# EAGLE design andEight_mouv4k (EAGLE 7.7.0)
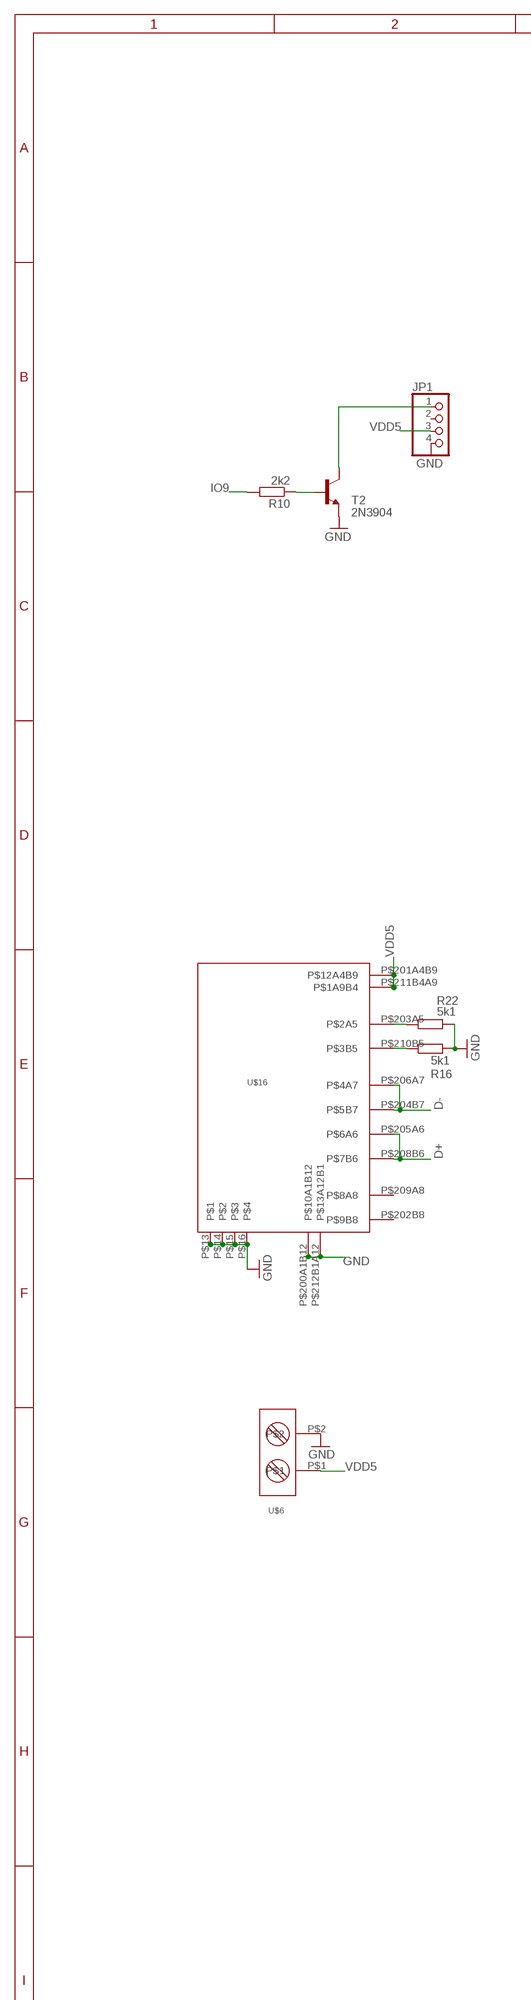
[diagram p0: schematic, sheet 1, part 1 of 2]
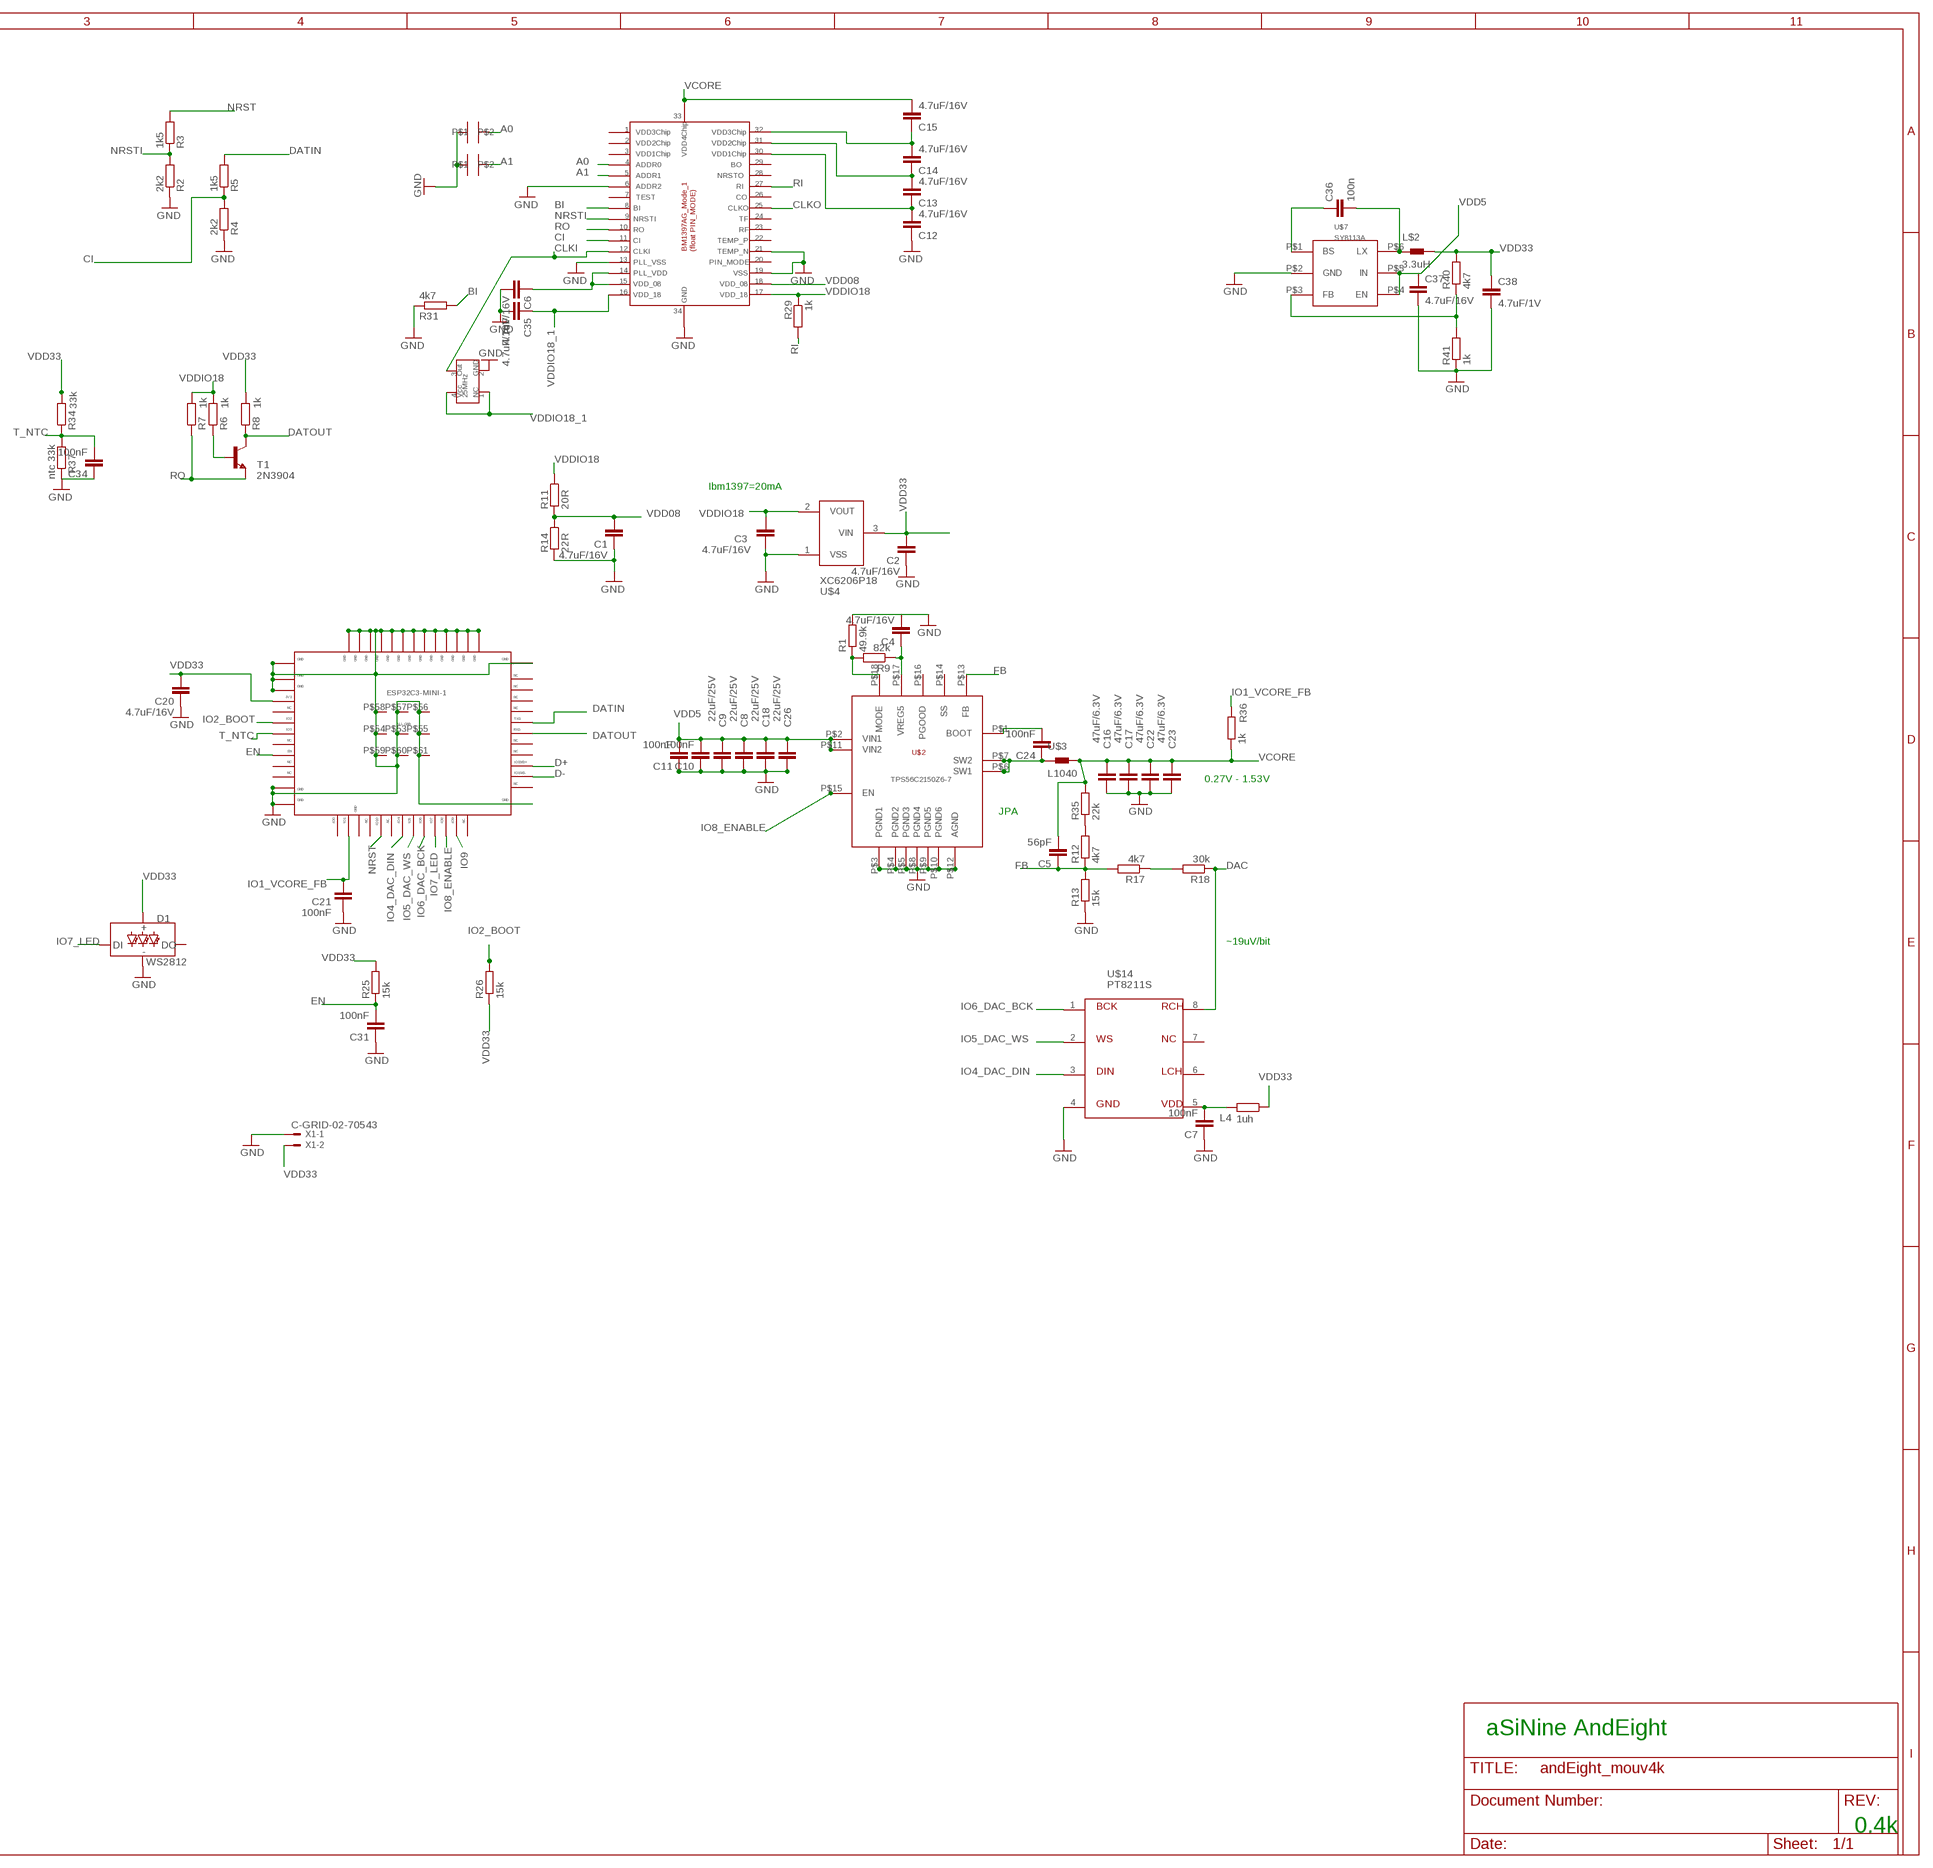
[diagram p1: schematic, sheet 1, part 2 of 2]

## Parts
A0  SOLDERJUMPER  [SOLDERJUMPER]
A1  SOLDERJUMPER  [SOLDERJUMPER]
C1  4.7uF/16V  C-EUC0402  [C0402]
C2  4.7uF/16V  C-EUC0402  [C0402]
C3  4.7uF/16V  C-EUC0402  [C0402]
C4  4.7uF/16V  C-EUC0402  [C0402]
C5  56pF  C-EUC0402  [C0402]
C6  4.7uF/16V  C-EUC0402  [C0402]
C7  100nF  C-EUC0402  [C0402]
C8  22uF/25V  C-EUC0805  [C0805]
C9  22uF/25V  C-EUC0805  [C0805]
C10  100nF  C-EUC0402  [C0402]
C11  100nF  C-EUC0402  [C0402]
C12  4.7uF/16V  C-EUC0402  [C0402]
C13  4.7uF/16V  C-EUC0402  [C0402]
C14  4.7uF/16V  C-EUC0402  [C0402]
C15  4.7uF/16V  C-EUC0402  [C0402]
C16  47uF/6.3V  C-EUC0805  [C0805]
C17  47uF/6.3V  C-EUC0805  [C0805]
C18  22uF/25V  C-EUC0805  [C0805]
C20  4.7uF/16V  C-EUC0603  [C0603]
C21  100nF  C-EUC0603  [C0603]
C22  47uF/6.3V  C-EUC0805  [C0805]
C23  47uF/6.3V  C-EUC0805  [C0805]
C24  100nF  C-EUC0402  [C0402]
C26  22uF/25V  C-EUC0805  [C0805]
C31  100nF  C-EUC0402  [C0402]
C34  100nF  C-EUC0402  [C0402]
C35  4.7uF/16V  C-EUC0402  [C0402]
C36  100n  C-EUC0402  [C0402]
C37  4.7uF/16V  C-EUC0402  [C0402]
C38  4.7uF/1V  C-EUC0402  [C0402]
D1  WS2812  WS2812_5050  [WS2812-5X5-4PIN]
ESP32C3-MINI-1  ESP32-C3-MINI-1  ESP32C3MINI  [ESP32C3MINI]
JP1  PINHD-1X4/90  [1X04/90]
L4  1uh  R-EU_R0402  [R0402]
L$2  3.3uH  NR201610  [NR201610]
R1  49.9k  R-EU_R0402  [R0402]
R2  2k2  R-EU_R0402  [R0402]
R3  1k5  R-EU_R0402  [R0402]
R4  2k2  R-EU_R0402  [R0402]
R5  1k5  R-EU_R0402  [R0402]
R6  1k  R-EU_R0402  [R0402]
R7  1k  R-EU_R0402  [R0402]
R8  1k  R-EU_R0402  [R0402]
R9  82k  R-EU_R0402  [R0402]
R10  2k2  R-EU_R0402  [R0402]
R11  20R  R-EU_R0402  [R0402]
R12  4k7  R-EU_R0402  [R0402]
R13  15k  R-EU_R0402  [R0402]
R14  22R  R-EU_R0402  [R0402]
R16  5k1  R-EU_R0402  [R0402]
R17  4k7  R-EU_R0402  [R0402]
R18  30k  R-EU_R0402  [R0402]
R22  5k1  R-EU_R0402  [R0402]
R25  15k  R-EU_R0402  [R0402]
R26  15k  R-EU_R0402  [R0402]
R29  1k  R-EU_R0402  [R0402]
R31  4k7  R-EU_R0402  [R0402]
R34  33k  R-EU_R0603  [R0603]
R35  22k  R-EU_R0402  [R0402]
R36  1k  R-EU_R0402  [R0402]
R37  ntc 33k  R-EU_R0402  [R0402]
R40  4k7  R-EU_R0402  [R0402]
R41  1k  R-EU_R0402  [R0402]
T1  2N3904  BC847  [SOT23]
T2  2N3904  BC847  [SOT23]
U$1  BM1397-1  [BM1391]
U$2  TPS56C2150Z6-7  [VQFN-HR]
U$3  L1040  [L1040]
U$4  XC6206P18  XC6206P  [SOT23]
U$6  DG301-50  [DG301-50]
U$7  SY8113A  [SOT23L-6]
U$14  PT8211S  PT8211  [SO-8]
U$16  USBCTHT  [USBCSMTTHT]
U$22  25MHz  OSC3225  [3225]
X1  C-GRID-02-70543  [70543-02]

## Nets
A0: A0.P$1 U$1.P$4
A1: A1.P$1 U$1.P$5
BI: R31.2 U$1.P$8
CI: R4.2 R5.1 U$1.P$11
CLKI: U$1.P$12 U$22.P$3
CLKO: U$1.P$25
D+: ESP32C3-MINI-1.P$27 U$16.P$205A6(P$6A6) U$16.P$208B6(P$7B6)
D-: ESP32C3-MINI-1.P$26 U$16.P$204B7(P$5B7) U$16.P$206A7(P$4A7)
DAC: R18.1 U$14.8
DATIN: ESP32C3-MINI-1.P$31 R5.2
DATOUT: ESP32C3-MINI-1.P$30 R8.1 T1.3(C)
EN: C31.2 ESP32C3-MINI-1.P$8 R25.1
FB: C5.1 R12.1 R13.2 R17.2 U$2.P$13(FB)
GND: A0.P$2 A1.P$2 C1.1 C2.1 C3.1 C4.2 C6.2 C7.1 C8.2 C9.2 C10.1 C11.1 C12.1 C16.2 C17.2 C18.2 C20.1 C21.1 C22.2 C23.2 C26.2 C31.1 C34.1 C35.2 C37.2 C38.2 D1.GND ESP32C3-MINI-1.P$1 ESP32C3-MINI-1.P$2 ESP32C3-MINI-1.P$11 ESP32C3-MINI-1.P$36 ESP32C3-MINI-1.P$37 ESP32C3-MINI-1.P$38 ESP32C3-MINI-1.P$39 ESP32C3-MINI-1.P$40 ESP32C3-MINI-1.P$41 ESP32C3-MINI-1.P$42 ESP32C3-MINI-1.P$43 ESP32C3-MINI-1.P$44 ESP32C3-MINI-1.P$45 ESP32C3-MINI-1.P$46 ESP32C3-MINI-1.P$47 ESP32C3-MINI-1.P$48 ESP32C3-MINI-1.P$49 ESP32C3-MINI-1.P$50 ESP32C3-MINI-1.P$51 ESP32C3-MINI-1.P$52 ESP32C3-MINI-1.P$53 ESP32C3-MINI-1.P$54 ESP32C3-MINI-1.P$55 ESP32C3-MINI-1.P$56 ESP32C3-MINI-1.P$57 ESP32C3-MINI-1.P$58 ESP32C3-MINI-1.P$59 ESP32C3-MINI-1.P$60 ESP32C3-MINI-1.P$61 JP1.4 R1.2 R2.1 R4.1 R13.1 R14.2 R16.2 R22.2 R31.1 R37.1 R41.1 T2.2(E) U$1.P$6 U$1.P$13 U$1.P$19 U$1.P$21 U$1.P$34 U$2.P$3(PGND1) U$2.P$4(PGND2) U$2.P$5(PGND3) U$2.P$8(PGND4) U$2.P$9(PGND5) U$2.P$10(PGND6) U$2.P$12(AGND) U$4.1(VSS) U$6.P$2 U$7.P$2(GND) U$14.4 U$16.P$13 U$16.P$14 U$16.P$15 U$16.P$16 U$16.P$200A1B12(P$10A1B12) U$16.P$212B1A12(P$13A12B1) U$22.P$2 X1.1
IO1_VCORE_FB: C21.2 ESP32C3-MINI-1.P$13 R36.2
IO2_BOOT: ESP32C3-MINI-1.P$5 R26.2
IO4_DAC_DIN: ESP32C3-MINI-1.P$18 U$14.3
IO5_DAC_WS: ESP32C3-MINI-1.P$19 U$14.2
IO6_DAC_BCK: ESP32C3-MINI-1.P$20 U$14.1
IO7_LED: D1.DI ESP32C3-MINI-1.P$21
IO8_ENABLE: ESP32C3-MINI-1.P$22 U$2.P$15(EN)
IO9: ESP32C3-MINI-1.P$23 R10.2
N$1: R10.1 T2.1(B)
N$2: C24.2 U$2.P$1(BOOT)
N$3: C24.1 U$2.P$6(SW1) U$2.P$7(SW2) U$3.P$1
N$6: C4.1 R9.1 U$2.P$17(VREG5)
N$7: R1.1 R9.2 U$2.P$18(MODE)
N$9: JP1.1 T2.3(C)
N$12: C36.1 U$7.P$1(BS)
N$17: C36.2 L$2.P$1 U$7.P$6(LX)
N$18: R40.1 R41.2 U$7.P$3(FB)
N$21: R16.1 U$16.P$210B5(P$3B5)
N$22: R22.1 U$16.P$203A5(P$2A5)
N$27: R6.1 T1.1(B)
N$28: R12.2 R35.1
N$39: R17.1 R18.2
NRST: ESP32C3-MINI-1.P$16 R3.2
NRSTI: R2.2 R3.1 U$1.P$9
P$5: C7.2 L4.2 U$14.5
RI: R29.2 U$1.P$27
RO: R7.1 T1.2(E) U$1.P$10
T_NTC: C34.2 ESP32C3-MINI-1.P$6 R34.1 R37.2
VCORE: C5.2 C15.2 C16.1 C17.1 C22.1 C23.1 R35.2 R36.1 U$1.P$33 U$3.P$2
VDD1: C12.2 C13.1 U$1.P$30
VDD2: C13.2 C14.1 U$1.P$31
VDD3: C14.2 C15.1 U$1.P$32
VDD5: C8.1 C9.1 C10.2 C11.2 C18.1 C26.1 C37.1 JP1.3 U$2.P$2(VIN1) U$2.P$11(VIN2) U$6.P$1 U$7.P$4(EN) U$7.P$5(IN) U$16.P$201A4B9(P$12A4B9) U$16.P$211B4A9(P$1A9B4)
VDD08: C1.2 R11.2 R14.1 U$1.P$18
VDD08_1: C6.1 U$1.P$14 U$1.P$15
VDD33: C2.2 C20.2 C38.1 D1.VCC ESP32C3-MINI-1.P$3 L4.1 L$2.P$2 R8.2 R25.2 R26.1 R34.2 R40.2 U$4.3(VIN) X1.2
VDDIO18: C3.2 R6.2 R7.2 R11.1 R29.1 U$1.P$17 U$4.2(VOUT)
VDDIO18_1: C35.1 U$1.P$16 U$22.P$1 U$22.P$4
Unconnected: D1.DO ESP32C3-MINI-1.P$4 ESP32C3-MINI-1.P$7 ESP32C3-MINI-1.P$9 ESP32C3-MINI-1.P$10 ESP32C3-MINI-1.P$12 ESP32C3-MINI-1.P$14 ESP32C3-MINI-1.P$15 ESP32C3-MINI-1.P$17 ESP32C3-MINI-1.P$24 ESP32C3-MINI-1.P$25 ESP32C3-MINI-1.P$28 ESP32C3-MINI-1.P$29 ESP32C3-MINI-1.P$32 ESP32C3-MINI-1.P$33 ESP32C3-MINI-1.P$34 ESP32C3-MINI-1.P$35 JP1.2 U$1.P$1 U$1.P$2 U$1.P$3 U$1.P$7 U$1.P$20 U$1.P$22 U$1.P$23 U$1.P$24 U$1.P$26 U$1.P$28 U$1.P$29 U$2.P$14(SS) U$2.P$16(PGOOD) U$14.6 U$14.7 U$16.P$202B8(P$9B8) U$16.P$209A8(P$8A8)

## Notes on the sheet
- Ibm1397=20mA
- 0.27V - 1.53V
- JPA
- ~19uV/bit
- aSiNine AndEight
- 0.4k

## Library data of the parts
A0 A1 = vishay-fet:SOLDERJUMPER
C1-C18 C20-C24 C26 C31 C34-C38 = rcl:C-EU: CAPACITOR, European symbol
D1 = SparkFun-LED:WS2812: Addressable RGB LED - 1 Wire Common names: WS2812, SK6812, Neopixel, APA-106, etc. SMD LED with built-in controller IC. Color: Red/Green/Blue SparkFun Products: LED-SMD RGB (WS2812) <https://www.sparkfun.com/products/11821> LED - RGB Addressable, PTH, 5mm Diffused (5 Pack) <https://www.sparkfun.com/products/12986> LED - RGB Addressable, PTH, 5mm Clear (5 Pack) <https://www.sparkfun.com/products/12999> Blynk Board - ESP8266 <https://www.sparkfun.com/products/13794> Datasheet referenced for footprint: WS2812B-PTH <https://cdn.sparkfun.com/datasheets/Components/LED/COM-12877.pdf>; PROD_ID: DIO-12503
ESP32C3-MINI-1 = esp32c3:ESP32C3MINI
JP1 = pinhead:PINHD-1X4: PIN HEADER
L4 R1-R14 R16-R18 R22 R25 R26 R29 R31 R34-R37 R40 R41 = rcl:R-EU_: RESISTOR, European symbol
L$2 = vishay-fet:NR201610
T1 T2 = transistor:BC847: NPN TRANSISTOR
U$1 = bm1387:BM1397-1
U$2 = vishay-fet:TPS56C2150Z6-7
U$3 = vishay-fet:L1040
U$4 = vishay-fet:XC6206P
U$6 = vishay-fet:DG301-50
U$7 = vishay-fet:SY8113A
U$14 = vishay-fet:PT8211
U$16 = usbc:USBC
U$22 = vishay-fet:OSC3225: Active oscillator 3225 pin 1 is either NC or Enable(pull high)
X1 = con-molex:C-GRID-02: CONNECTOR wire to board 2.54 mm (0.100") pitch header; OC_FARNELL: unknown; OC_NEWARK: unknown

## Board
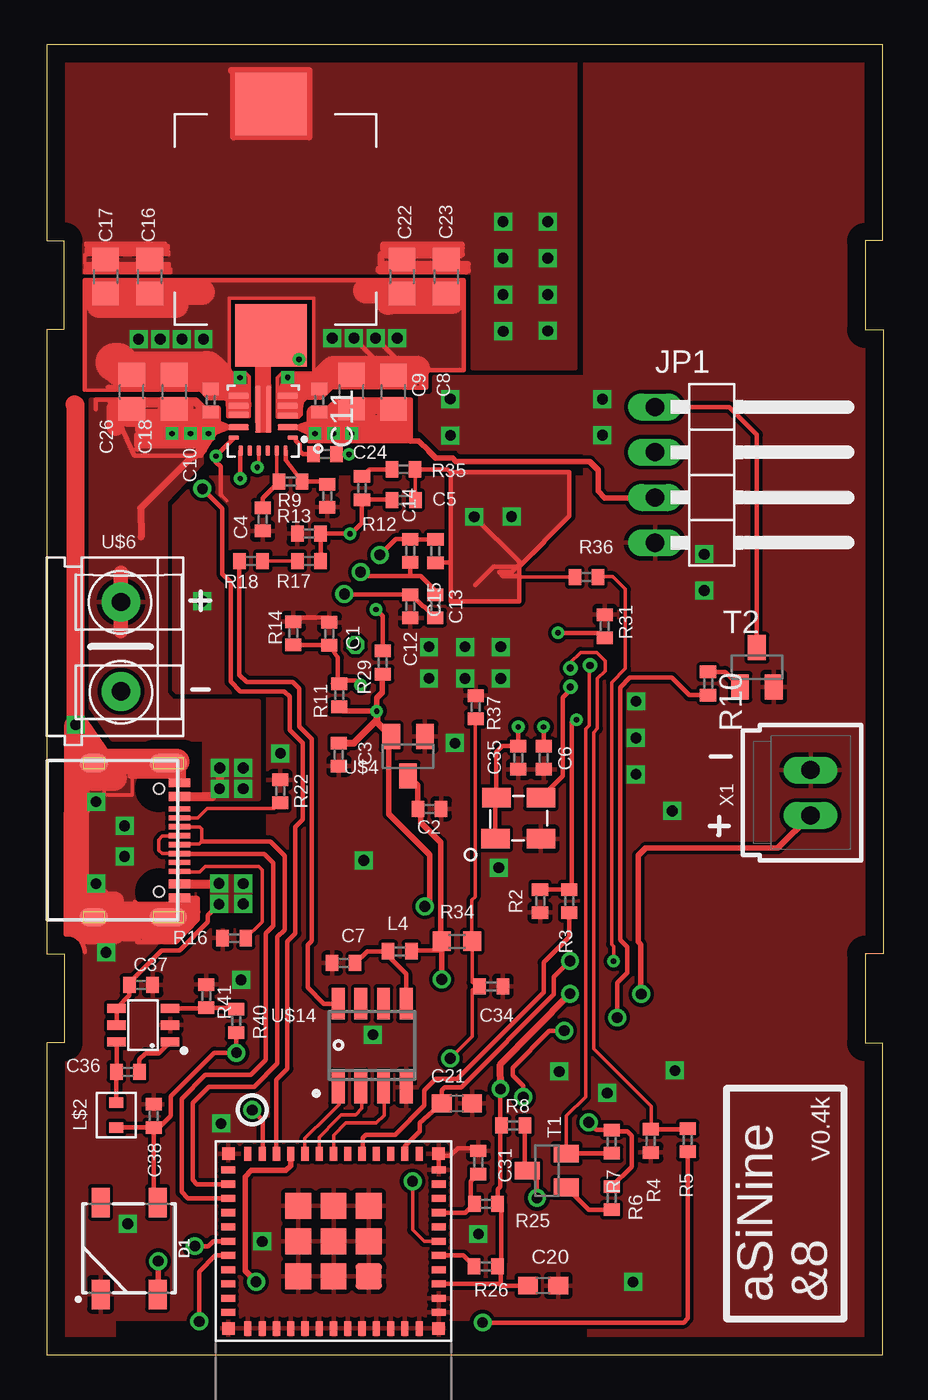
[diagram p2: board, top side]
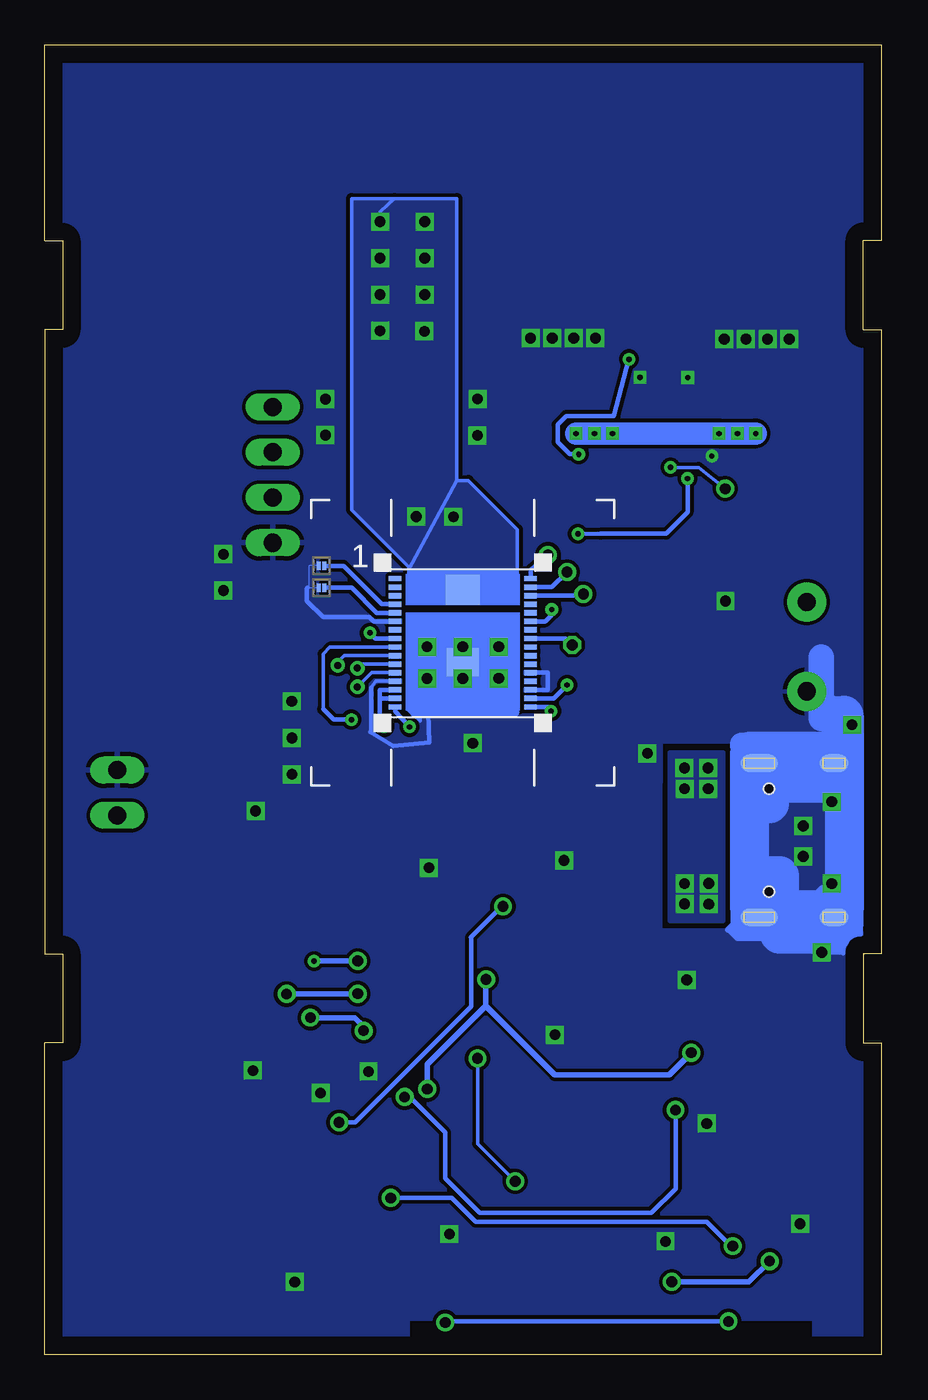
[diagram p3: board, bottom side, seen from below]

Size 46.91 x 73.5 mm. Coordinates in mm from the lower left corner, seen from the top.
Outline: 0,0 46.9,0 46.9,17.5 45.9,17.5 45.9,22.5 46.91,22.5 46.91,57.5 45.9,57.5 45.9,62.5 46.9,62.5 46.9,73.5 0,73.5 0,62.5 0.99,62.51 1,57.5 0,57.5 0,22.5 1,22.5 1,17.5 0,17.5 0,0
Copper layers (1*16): Top 0.035mm / dielectric 1.5mm / Bottom 0.035mm
Design rules "default": minimum track width 10mil, minimum drill 24mil, track to track 8mil, track to pad 8mil, pad to pad 8mil, via to via 8mil, smd to smd 8mil, copper to edge 40mil, drill to drill 8mil, minimum pad ring 10mil, minimum via ring 8mil, stop-mask expansion 4mil, vias tented up to drill 0mil, thermal gap 10mil
tRestrict: area 3.9,0.1 to 9.7,1.9; area 3.9,0.1 to 9.7,1.9; area 22.4,0.3 to 30.3,1.9
bRestrict: area 3.9,0.1 to 9.7,1.9; area 22.4,0.3 to 26.4,1.9

### Footprints (pad centres in the part's own frame; a part is rotated, then mirrored left to right if it is on the bottom)
SOLDERJUMPER = smd 0.229 x 0.457: P$1 -0.152,0; P$2 0.152,0
C0402 = smd 0.7 x 0.9: 1 -0.65,0; 2 0.65,0
C0805 = smd 1.3 x 1.5: 1 -0.95,0; 2 0.95,0
C0603 = smd 1.1 x 1: 1 -0.85,0; 2 0.85,0
WS2812-5X5-4PIN = smd 1.651 x 1: DI 2.577,1.6; DO -2.577,-1.6; GND 2.577,-1.6; VCC -2.577,1.6
ESP32C3MINI = smd 0.8 x 0.4: P$1 -5.9,4; P$2 -5.9,3.2; P$3 -5.9,2.4; P$4 -5.9,1.6; P$5 -5.9,0.8; P$6 -5.9,0; P$7 -5.9,-0.8; P$8 -5.9,-1.6; P$9 -5.9,-2.4; P$10 -5.9,-3.2; P$11 -5.9,-4; P$25 5.9,-4; P$26 5.9,-3.2; P$27 5.9,-2.4; P$28 5.9,-1.6; P$29 5.9,-0.8; P$30 5.9,0; P$31 5.9,0.8; P$32 5.9,1.6; P$33 5.9,2.4; P$34 5.9,3.2; P$35 5.9,4 | smd 0.4 x 0.8: P$12 -4.8,-4.9; P$13 -4,-4.9; P$14 -3.2,-4.9; P$15 -2.4,-4.9; P$16 -1.6,-4.9; P$17 -0.8,-4.9; P$18 0,-4.9; P$19 0.8,-4.9; P$20 1.6,-4.9; P$21 2.4,-4.9; P$22 3.2,-4.9; P$23 4,-4.9; P$24 4.8,-4.9; P$36 4.8,4.9; P$37 4,4.9; P$38 3.2,4.9; P$39 2.4,4.9; P$40 1.6,4.9; P$41 0.8,4.9; P$42 0,4.9; P$43 -0.8,4.9; P$44 -1.6,4.9; P$45 -2.4,4.9; P$46 -3.2,4.9; P$47 -4,4.9; P$48 -4.8,4.9 | smd 0.7 x 0.7: P$49 5.9,4.9; P$50 5.9,-4.9; P$51 -5.9,-4.9; P$52 -5.9,4.9 | smd 1.45 x 1.45: P$53 0,0; P$54 1.975,0; P$55 -1.975,0; P$56 -1.975,1.975; P$57 0,1.975; P$58 1.975,1.975; P$59 1.975,-1.975; P$60 0,-1.975; P$61 -1.975,-1.975
1X04/90 = drill 1.016 long: 1 -3.81,-3.81; 2 -1.27,-3.81; 3 1.27,-3.81; 4 3.81,-3.81
R0402 = smd 0.7 x 0.9: 1 -0.65,0; 2 0.65,0
NR201610 = smd 0.6 x 0.77: P$1 -0.7,0; P$2 0.7,0
R0603 = smd 1 x 1.1: 1 -0.85,0; 2 0.85,0
SOT23 = smd 1 x 1.4: 1 -0.95,-1.1; 2 0.95,-1.1; 3 0,1.1
BM1391 = smd 0.7 x 0.3: P$1 3.8,-3.6; P$2 3.8,-3.12; P$3 3.8,-2.64; P$4 3.8,-2.16; P$5 3.8,-1.68; P$6 3.8,-1.2; P$7 3.8,-0.72; P$8 3.8,-0.24; P$9 3.8,0.24; P$10 3.8,0.72; P$11 3.8,1.2; P$12 3.8,1.68; P$13 3.8,2.16; P$14 3.8,2.64; P$15 3.8,3.12; P$16 3.8,3.6; P$17 -3.8,3.6; P$18 -3.8,3.12; P$19 -3.8,2.64; P$20 -3.8,2.16; P$21 -3.8,1.68; P$22 -3.8,1.2; P$23 -3.8,0.72; P$24 -3.8,0.24; P$25 -3.8,-0.24; P$26 -3.8,-0.72; P$27 -3.8,-1.2; P$28 -3.8,-1.68; P$29 -3.8,-2.16; P$30 -3.8,-2.64; P$31 -3.8,-3.12; P$32 -3.8,-3.6 | smd 1.9 x 1.7: P$33 0,-2.98 | smd 1.8 x 1.6: P$34 0,1.1
VQFN-HR = smd 0.6 x 0.25: P$1 -1.65,0.925; P$12 1.65,0.925 | smd 1.15 x 0.35: P$2 -1.375,0.35; P$11 1.375,0.35 | smd 1.15 x 0.3: P$3 -1.375,-0.3; P$4 -1.375,-0.85; P$5 -1.375,-1.4; P$8 1.375,-1.4; P$9 1.375,-0.85; P$10 1.375,-0.35 | smd 0.3 x 2.6: P$6 -0.3,-0.65; P$7 0.3,-0.65 | smd 0.25 x 0.6: P$13 1.25,1.65; P$14 0.75,1.65; P$15 0.25,1.65; P$16 -0.25,1.65; P$17 -0.75,1.65; P$18 -1.25,1.65
L1040 = smd 3.5 x 4: P$1 -6.5,0; P$2 6.5,0
DG301-50 = drill 1.016 pad 2.184: P$1 -2.5,0.05; P$2 2.5,0.05
SOT23L-6 = smd 0.508 x 1.016: P$1 -0.95,-1.45; P$2 0,-1.45; P$3 0.95,-1.45; P$4 0.95,1.55; P$5 0,1.55; P$6 -0.95,1.55
SO-8 = smd 0.72 x 1.78: 1 -1.905,-2.35; 2 -0.635,-2.35; 3 0.635,-2.35; 4 1.905,-2.35; 5 1.905,2.35; 6 0.635,2.35; 7 -0.635,2.35; 8 -1.905,2.35
USBCSMTTHT = smd 1 x 1.6 bottom: P$1 -4.32,2.6; P$2 4.32,2.6 | smd 1 x 2.1 bottom: P$6 4.32,6.78; P$115 -4.32,6.78 | smd 1 x 1.6: P$13 -4.32,2.6; P$14 4.32,2.6 | smd 1 x 2.1: P$15 -4.32,6.78; P$16 4.32,6.78 | smd 0.5 x 1.2: P$200A1B12 -3.225,7.4; P$201A4B9 -2.45,7.4; P$211B4A9 2.45,7.4; P$212B1A12 3.225,7.4 | smd 0.3 x 1.2: P$202B8 -1.75,7.4; P$203A5 -1.25,7.4; P$204B7 -0.75,7.4; P$205A6 -0.25,7.4; P$206A7 0.25,7.4; P$208B6 0.75,7.4; P$209A8 1.25,7.4; P$210B5 1.75,7.4 | hole 0.6: 2.89,6.25; -2.89,6.25
3225 = smd 1.6 x 1.1: P$1 -1.3,-1.15; P$2 1.25,-1.15; P$3 1.25,1.15; P$4 -1.25,1.15
70543-02 = drill 1.016 long: 1 -1.27,0; 2 1.27,0

### Placement (x,y rotation side)
A0  31.38,44.27 180 bottom
A1  31.38,43.03 180 bottom
C1  15.85,40.44 270 top
C2  21.48,30.63 180 top
C3  16.39,33.67 90 top
C4  12.11,46.87 270 top
C5  20.02,47.96 0 top
C6  27.88,33.5 270 top
C7  16.66,21.98 0 top
C8  19.45,54.02 90 top
C9  17.1,54.02 90 top
C10  9.2,53.55 270 top
C11  15.29,53.55 270 top
C12  20.4,41.99 90 top
C13  21.8,42 90 top
C14  20.39,45.11 90 top
C15  21.81,45.09 270 top
C16  5.79,60.49 270 top
C17  3.31,60.49 270 top
C18  7.16,54.02 90 top
C20  27.84,3.89 180 top
C21  23.01,14.11 180 top
C22  19.93,60.49 270 top
C23  22.41,60.49 270 top
C24  15.61,50.52 180 top
C26  4.78,54.02 90 top
C31  24.21,10.8 270 top
C34  24.94,20.68 180 top
C35  26.45,33.5 270 top
C36  4.56,15.89 180 top
C37  5.3,20.75 0 top
C38  6.02,13.41 90 top
D1  4.63,5.98 270 top
ESP32C3-MINI-1  16.09,6.38 180 top
JP1  37.93,49.37 270 top
L4  19.81,22.65 180 top
L$2  3.91,13.45 270 top
R1  15.75,48.2 270 top
R2  27.67,25.46 90 top
R3  29.32,25.46 270 top
R4  33.88,12.01 90 top
R5  35.95,12.05 270 top
R6  31.69,8.8 90 top
R7  31.69,11.97 90 top
R8  26.17,12.87 180 top
R9  13.69,48.99 0 top
R10  37.09,37.66 270 top
R11  16.4,37 90 top
R12  17.69,48.62 90 top
R13  14.71,46.07 0 top
R14  13.84,40.48 90 top
R16  10.52,23.38 180 top
R17  14.71,44.53 0 top
R18  11.47,44.53 0 top
R22  13.09,31.61 90 top
R25  24.64,8.48 0 top
R26  24.63,4.97 180 top
R29  18.85,38.84 90 top
R31  31.31,40.87 270 top
R34  23.02,23.2 180 top
R35  20.02,49.67 0 top
R36  30.27,43.62 0 top
R37  24.06,36.33 270 top
R40  10.63,18.73 270 top
R41  8.95,20.12 270 top
T1  28.05,10.34 90 top
T2  39.83,38.58 0 top
U$1  23.46,39.95 180 bottom
U$2  12.15,52.38 180 top
U$3  12.59,63.68 90 top
U$4  20.27,33.59 180 top
U$6  4.12,39.73 270 top
U$7  5.47,18.5 90 top
U$14  18.26,17.36 0 top
U$16  0.05,28.87 270 top
U$22  26.47,30.1 0 top
X1  42.84,31.54 270 top

### Tracks (layer width: path | path; a pad name or v marks a point on that pad's centre or on a via)
A0
  Bottom 0: 31.21,44.25 A0.P$1
  Bottom 0.254: U$1.P$4 28.01,42.11 30.15,44.25 31.21,44.25
A1
  Bottom 0: 31.21,43.05 A1.P$1
  Bottom 0.254: U$1.P$5 28.28,41.63 29.7,43.05 31.21,43.05
BI  (via drill 0.3)
  Top 0.254: v28.68,40.5 31.03,40.5 R31.2
  Bottom 0.254: U$1.P$8 28.36,40.19 v28.68,40.5
CI  (via drill 0.4)
  Top 0.203: v29.38,38.52 29.38,38.83 29.95,39.4 30.85,39.4 31.32,38.92 31.32,38.38 30.89,37.94 30.89,35.14 30.68,34.92 30.68,17.18 33.9,13.95 33.9,12.68 R4.2
  Top 0.254: R4.2 35.91,12.66 R5.1
  Bottom 0.203: U$1.P$11 29.2,38.75 v29.38,38.52
CLKI  (via drill 0.4)
  Top 0.254: 27.7,31.17 U$22.P$3 28.95,32.48 28.95,36.88 29.38,37.3 v29.38,37.48
  Bottom 0.203: v29.38,37.48 28.57,38.27 U$1.P$12
CLKO  (via drill 0.6)
  Bottom 0.254: U$1.P$25 17.69,40.19 v17.32,39.83
D+
  Top 0.203: U$16.P$208B6 6.48,28.12 6.3,28.3 6.3,28.9 6.5,29.1 7.43,29.1 U$16.P$205A6
  Top 0.254: ESP32C3-MINI-1.P$27 10.18,8.79 7.93,8.79 7.58,9.14 7.58,14.38 8.9,15.7 11.45,15.7 12.3,16.55 12.3,23.65 12.7,24.05 12.7,27.6 12.2,28.1 7.47,28.1 U$16.P$208B6
D-
  Top 0.203: U$16.P$204B7 8.58,29.62 8.7,29.5 8.7,28.8 8.55,28.65 7.48,28.65 U$16.P$206A7
  Top 0.254: ESP32C3-MINI-1.P$26 8.42,9.57 8.19,9.82 8.19,14.14 9.1,15.05 11.65,15.05 12.95,16.35 12.95,23.45 13.35,23.85 13.35,28 12.55,28.8 8.7,28.8
DAC
  Top 0.254: U$14.8 16.34,19.7 15.55,19.7 14.64,20.61 14.64,22.99 14.88,23.22 14.88,34.54 14.35,35.06 14.18,35.25 14.18,37.38 13.8,37.74 11.21,37.74 10.81,38.15 R18.1 10.62,44.51
DATIN  (via drill 0.6 pad 0.61)
  Top 0.254: ESP32C3-MINI-1.P$31 9.47,5.58 8.57,4.67 v8.57,1.88 | v24.45,1.82 35.72,1.82 35.95,2.05 R5.2
  Bottom 0.254: v8.57,1.88 24.38,1.88 v24.45,1.82
DATOUT  (via drill 0.6)
  Top 0.254: v8.32,6.11 9.07,6.11 9.34,6.38 ESP32C3-MINI-1.P$30 | R8.1 26.82,10.47 T1.3 27.5,9.79 v27.5,8.8
  Bottom 0.254: v8.32,6.11 8.41,6.11 9.78,7.48 22.75,7.48 24.07,8.8 v27.5,8.8
EN
  Top 0.254: 22.03,7.96 23.47,7.96 R25.1 23.79,8.66 23.79,9.73 C31.2
  Top 0.305: 22.03,7.96 ESP32C3-MINI-1.P$8
FB  (via drill 0.3)
  Top 0.203: 10.88,50.71 U$2.P$13
  Top 0.254: C5.1 19.16,47.97 R12.1 17.69,46.67 17.09,46.07 16.96,46.07 | R17.2 15.36,44.78 R13.2 16.96,46.07 | v17.01,46.06 16.98,46.06 16.96,46.07 | 10.88,50.71 10.88,49.17 v10.86,49.16
  Bottom 0.254: v10.86,49.16 10.86,47.27 12.06,46.07 15.75,46.07 v17.01,46.06
GND  (via drill 0.3, 0.6)
  Top 0.203: 1.9,32.35 3.25,32.35 3.25,31.4 4.8,31.4 4.8,33.15 2.65,33.15 U$16.P$13 | 3.05,33.3 6.83,33.3 U$16.P$15 | 7.3,33.3 7.55,33.3 7.55,33.05 | U$16.P$200A1B12 7.45,32.15 | 7.35,25.45 7.45,25.45 U$16.P$212B1A12 | 9.8,48.23 10.11,47.92 | U$16.P$14 2.65,25.1 2.08,25.68 1.72,25.68 1.68,25.64 | U$16.P$16 6.83,24.84 6.83,24.85 | 21.28,54.26 16.02,54.26 15.42,53.66 14.55,53.66 14.29,53.38 14.29,52.74 14.15,52.62 12.95,52.62 12.95,54.83 13.2,55.08 14.97,55.08 14.97,59.28 10.23,59.28 10.23,55.08 11.18,55.08 11.38,54.88 11.38,52.62 10.15,52.62 10.15,53.51 10,53.66 9.07,53.66 8.62,54.11 2.12,54.12 2.12,54.62 | 2.45,60.15 2.46,60.15 2.46,59.7 2.33,59.7 2.33,60.28
  Top 0.254: ESP32C3-MINI-1.P$11 ESP32C3-MINI-1.P$51 22.17,11.16 22.61,11.16 23.05,11.6 24.16,11.6 C31.1 | R14.2 14.08,41.13 14.3,41.35 15.8,41.35 C1.1 | 8,25.05 7.75,25.05 | 7.75,25.05 7.75,25.21 | 7.75,25.21 7.75,25.65 | 7.75,25.65 7.2,25.65 7.2,25.05 5.3,25.05 4.95,25.4 4.95,25.25 5.35,24.85 6.83,24.85 7.9,24.85 | 8,24.45 8,24.55 7.62,24.93 | 7.62,24.93 7.55,25 7.55,25.45 7.35,25.45 7.35,25.05 | 6.55,32.9 7.2,32.9 7.2,32.15 7.45,32.15 7.7,32.15 7.7,33.05 7.55,33.05 7.55,32.3 7.4,32.3 7.4,32.8 | 1.09,24.09 1.09,23.6 1.15,23.6 | 1.15,23.6 arc-90 2.14,22.61 | 1.15,23.6 1.6,23.6 1.6,23.98 3.21,23.98 | 3.34,23.98 v3.34,22.57 | 2.9,23.34 5.17,23.34 5.17,23.26 | 8.04,24.31 7.88,24 8.1,24.8 8.06,24.84 8.35,24.84 8.38,24.86 8.35,24.86 8.24,24.75 | 8.39,24.57 8.48,25.06 3.39,25.06 3.39,23.48 7,23.48 | 7.45,23.66 3.54,23.68 | 7.75,25.65 8.45,25.64 8.48,25.61 8.48,24.85 | 7.95,25.43 8.41,25.43 8.41,25.23 7.76,25.23 7.75,25.21 | 7.75,25.05 7.62,24.93 | 2.13,54.27 2.13,60.28 2.33,60.28 23.38,60.28 23.38,55.24 21.29,55.24 21.29,54.27 20,54.27 v17.24,57.03 | 21.28,54.26 21.22,54.26 v18.45,57.03 | 1.7,35.25 1.7,32.1 v2.77,31.02 | 3.44,54.29 3.44,54.28 4.19,54.28 | 5.08,23.2 5.08,23.16 7.28,23.16 8.48,24.43 8.49,25.6 8.31,25.6 8.21,24.34 7.12,23.3 7.12,23.5 6.98,23.32 5.45,23.32 | U$2.P$12 10.5,51.42 v9.5,50.42 9.5,50.08 9.76,49.82 9.76,48.27 9.8,48.23
  Top 0.305: C8.2 C9.2 | 4.7,32.56 4.7,32.46 7.08,32.46 | 4.34,25.21 4.34,25.26 7.06,25.26 | 8.48,24.85 3.6,24.85 3.39,25.06 | 3.39,23.48 3.39,23.52 3.54,23.68 | 8.38,24.86 6.13,24.86 5.71,24.44 4.77,24.44 v2.77,26.44 | v1.64,35.35 v1.64,35.34 1.61,35.31
  Top 0.406: 3.34,23.98 3.21,23.98 | 3.21,23.98 1.7,25.49 | 3.21,23.98 3.21,24.11 3.17,24.15
  Top 1.016: 1.7,25.49 3.84,25.49 3.84,23.54 2.25,23.54 2.25,23.56 | 3.15,25.54 3.17,25.54 3.17,24.15 7.16,24.15 7.58,24.56 5.16,24.56 4.96,24.76 | 1.57,53.33 1.61,53.3 1.61,35.31
  Top 1.422: 1.68,24.11 1.68,25.64 1.7,35.25 3.05,33.3 7.3,33.3 | 1.9,32.35 3.8,32.35 | 10.01,54.43 10.27,54.43 10.68,54.02 10.68,53.84 10.76,53.76 10.76,53.32 10.77,53.3 | 20.8,55.33 16.08,55.33 15.12,54.37 13.99,54.37 13.72,54.09 13.72,53.44 13.55,53.27 13.68,53.27 13.68,54.04 14.05,54.41 15.21,54.41 15.41,54.61 15.46,54.61 15.55,54.7 15.57,54.7 15.77,54.9 20.23,54.9 20.25,54.91 | 8.74,59.6 3.54,59.6 2.94,59.59 2.94,58.89 3.57,58.88 7.25,58.88 | 17.9,59.69 22.75,59.69 22.77,59.66 22.77,59.12 22.74,59.09 19.19,59.09 19.16,59.06
  Top 2.184: 3.85,55.66 4.01,55.66 4.46,55.22 8.97,55.22 9.41,54.78
  Bottom 0: A1.P$2 31.55,43.05 32.15,43.05 32.1,43.1 32.1,44.25 32.08,44.27 A0.P$2 | 26.1,41.12 26.1,41.11 v25.46,39.72 | v25.46,39.72 25.2,39.82 26.1,38.91 | v25.46,39.72 23.47,39.82 v23.47,39.72 | v23.47,39.72 22.13,39.84 v21.45,39.72 20.85,41.12 20.8,41.12 | 20.8,38.84 21.28,38.84 v21.45,37.95 | v21.45,37.95 v23.47,37.94 | v23.47,37.94 v25.46,37.94 26.1,36.7 | v23.47,37.94 23.45,39.83 v23.47,39.72 | v21.45,37.95 20.83,36.7 20.8,36.7 20.8,36.4 20.5,36.1 | v23.47,37.94 23.45,38.84 U$1.P$34
  Bottom 0.203: U$1.P$13 27.28,37.8 28.34,37.8 28.6,37.45 | 26.12,35.92 26.12,35.91 | 26.12,35.91 26.15,35.9 26.04,36.46 26.25,35.91 26.23,36 | 26.56,36.2 26.17,35.84 | 26.17,35.84 25.85,35.55 25.85,35.8 25.93,35.8 | 26.12,35.91 26.12,35.88 26.17,35.84
  Bottom 0.254: U$1.P$6 28.45,41.15 28.7,41.4 31.3,41.4 32.2,42.3 32.2,43 32.15,43.05 | 28.6,37.45 28.6,35 28.65,34.95 27.35,34.15 25.35,34.35 25.4,36 | 2.14,22.52 2.14,22.57 | 1.52,24.84 1.12,24.84 arc-90 1.14,24.82 1.14,23.6 arc-90 2.14,22.6 2.14,22.57 | v3.34,22.57 2.14,22.57 | 7.36,33.88 6.84,33.88 6.84,34.27 | U$1.P$21 18.7,38.27 18.7,37.31 U$1.P$19 | 7.34,24.98 7.34,25.04 7.35,25.05
  Bottom 0.305: 8.16,25.21 8.24,25.21 8.3,25.16 8.3,24.14 8.61,23.83 8.53,23.83 8.05,23.36 6.79,23.36 6.79,23.82 7.9,23.82 7.9,24.14 8.12,24.14 8.12,24.13 8.12,23.55 8.28,23.55 8.28,23.91 7.96,23.91 | 7.96,23.91 7.96,23.59 6.95,23.59 | 7.96,23.91 7.96,24.33 7.34,24.95
  Bottom 0.406: 20.5,36.1 20.5,36 25.4,36 26.23,36
  Bottom 1.016: 1.52,24.84 1.52,24.05 arc90 1.6,23.98
  Bottom 1.27: 6.84,34.27 7.84,34.27 7.84,34.16
  Bottom 1.422: 3.35,39.15 3.38,39.15 3.38,35.69
  Bottom 2.184: 2.76,35.88 2.08,35.88 2.08,24.98 7.34,24.98 7.34,24.95 7.36,24.95 7.36,33.88 2.33,33.88 2.33,32.05 6.28,32.05 6.28,30.91 | 7.35,25.05 7.35,26.89 5.71,26.89 5.71,23.61 2.79,23.61 2.79,25.43
  other vias: 9.79,12.98 12.1,6.37 32.89,4.09 31.44,14.69 28.75,15.9 4.55,7.35 17.79,27.74 25.36,27.32 35.08,30.52 13.11,33.74 8.8,56.98 7.59,56.98 6.38,56.98 5.16,56.98 16.02,57.03 19.66,57.03 4.38,29.68 4.38,27.96 10.91,21.03 33.05,32.57 33.05,34.6 33.06,36.67 22.63,53.62 22.65,51.57 36.88,44.91 36.88,42.87 35.23,15.95 24.21,6.78 18.3,17.96 22.9,34.32 31.17,53.62 31.17,51.59 8.73,42.29 10.85,54.82 13.52,54.82
  pour Bottom: 23.52,73.15 46.55,73.15 46.65,0.35 23.52,0.65
  pour Bottom: 31.8,73.1 31.9,0.4 0.4,0.6 0.4,33.8 8.3,33.8 8.3,23.8 12.4,23.8 12.3,73.3
  pour Bottom: 12.9,73.26 12.9,34.4 8.3,34.4 8.3,30.1 0.5,30.1 0.5,73.26
  pour Bottom: 20.4,36.3 20.4,35.6 22.7,35.6 23.9,34.4 32.3,34.4 32.3,34.9 32.3,41.5 20.4,41.5
  pour Top: 0.5,33.8 0.5,0.6 46.45,0.6 46.45,73.17 30.17,73.19 30.18,49.26 8.69,49.23 7.12,47.66 7.14,37.29 7.29,37.13 12.4,37.15 12.4,23.85 8.35,23.85 8.35,33.8
  pour Bottom: 12.4,42.32 7.85,42.32 7.85,36.5 12.4,36.5
  pour Top: 7.46,60.12 23.27,60.12 23.27,55.35 21.18,55.35 21.18,54.38 16.49,54.38 16.49,54.37 16.02,54.37 15.4,53.76 14.52,53.76 14.17,53.41 14.17,52.85 14.03,52.71 13.1,52.71 13.08,52.73 13.08,54.78 13.27,54.97 15.04,54.97 15.06,54.99 15.06,59.33 15.06,59.34 10.2,59.34 10.16,59.3 10.16,55.03 10.15,55.02 11.07,55.02 11.28,54.82 11.28,52.73 11.27,52.71 10.29,52.71 10.26,52.73 10.26,53.56 10.04,53.78 9.11,53.78 8.66,54.23 2.26,54.26 2.26,60.18 7.42,60.15
  pour Top: 21.73,54.84 21.73,53.97 21.55,53.77 20.95,53.77 20.95,51.87 21.04,51.87 22.08,50.83 23.02,50.83 23.21,50.65 31.21,50.65 31.21,54.83 31.21,54.84
IO1_VCORE_FB  (via drill 0.3, 0.6)
  Top 0.203: R36.2 30.95,43.65 31.75,43.65 32.45,42.95 32.45,38.5 31.68,37.73 31.68,23.04 31.8,22.91 v31.8,22.09
  Top 0.254: ESP32C3-MINI-1.P$13 20.09,11.69 20.8,12.4 20.93,12.54 20.93,13.01 C21.2 22.16,14.85 22.32,15.01 23.25,15.01 28.45,20.21 28.45,21.2 v29.35,22.1
  Bottom 0.305: v29.35,22.1 v31.79,22.1 v31.8,22.09
IO2_BOOT
  Top 0.254: ESP32C3-MINI-1.P$5 23.37,5.58 R26.2
IO4_DAC_DIN
  Top 0.203: ESP32C3-MINI-1.P$18 16.09,12.33 16.79,13.03 18.5,13.03 18.93,13.45 18.93,15.61 U$14.3
IO5_DAC_WS
  Top 0.203: ESP32C3-MINI-1.P$19 15.29,12.21 16.28,13.21 16.54,13.46 17.32,13.46 17.69,13.82 17.69,15.61 U$14.2
IO6_DAC_BCK
  Top 0.203: ESP32C3-MINI-1.P$20 14.49,12.15 15.79,13.45 16.4,14.06 16.4,15.62 U$14.1
IO7_LED  (via drill 0.6)
  Top 0.305: ESP32C3-MINI-1.P$21 13.69,10.62 13.43,10.35 11.49,10.35 11.14,10 11.14,4.71 v11.75,4.1 | v6.26,5.26 6.26,3.43 D1.DI
  Bottom 0.305: v11.75,4.1 7.42,4.1 v6.26,5.26
IO8_ENABLE  (via drill 0.3, 0.6)
  Top 0.203: U$2.P$15 11.9,49.78 v11.81,49.78
  Top 0.254: ESP32C3-MINI-1.P$22 12.89,15.44 13.5,16.05 13.5,23.2 13.95,23.65 13.95,29.62 14.36,30.04 14.36,34.33 13.64,35.05 13.64,36.92 13.34,37.23 10.87,37.23 10.32,37.77 10.32,43.34 9.86,43.81 9.86,47.47 v8.74,48.59
  Bottom 0.203: v11.81,49.78 10.24,49.78 v8.74,48.59
IO9  (via drill 0.6)
  Top 0.203: 12.12,11.29 12.09,11.29 ESP32C3-MINI-1.P$23
  Top 0.254: 12.12,11.29 12.12,13.15 v11.54,13.73 | v32.01,18.92 32.01,20.86 32.55,21.41 32.55,22.89 32.16,23.29 32.16,37.44 32.7,37.99 35.06,37.99 36.03,37.02 R10.2 | v26.73,14.46 26.73,15.09 26.14,15.68 26.14,16.09 28.19,18.16 v29.02,18.18
  Bottom 0.254: v11.54,13.73 11.54,9.32 12.9,7.96 22.52,7.96 24.45,9.89 24.45,12.47 26.36,14.38 26.57,14.38 v26.73,14.46
  Bottom 0.305: v29.02,18.18 29.02,18.42 29.51,18.91 31.99,18.91 v32.01,18.92
N$1
  Top 0.254: R10.1 38.05,38.31 T2.1
N$2
  Top 0.254: U$2.P$1 13.96,51.46 13.96,51.3 14.2,51.06 14.2,50.7 14.38,50.52 C24.2
N$3  (via drill 0.3)
  Top 0.203: 12.47,54.4 12.47,55.36 12.3,55.53
  Top 0.254: C24.1 v16.96,50.52 | U$2.P$7 U$2.P$6 11.91,52.49 11.91,52.33 | 11.86,51.95 11.86,51.86 | 11.86,51.86 12.47,51.86 12.47,54.4 | 11.84,54.3 11.84,52.26 | 11.84,52.26 11.84,51.86 11.86,51.86 | U$3.P$1 12.59,56.34 | 12.59,56.34 12.14,55.9 | v14.15,55.85 13.09,55.85 12.59,56.34 | 11.91,52.33 12.18,52.33 12.18,52.35 12.14,52.38 | 11.91,52.33 11.84,52.26
  Top 0.813: 12.18,52.33 12.18,54.55
  Top 0.9: 12.15,52.38 12.14,52.38 12.14,55.9
  Bottom 0.254: v14.15,55.85 15,52.67 17.66,52.67 18.15,52.18 18.15,51.21 17.46,50.52 v16.96,50.52
N$6
  Top 0.203: U$2.P$17 12.9,49.3
  Top 0.254: C4.1 12.11,48.07 R9.1 13.04,49.16 12.9,49.3
N$7
  Top 0.254: U$2.P$18 13.4,50.18 R9.2 15.6,48.99 R1.1
N$9
  Top 0.254: T2.3 39.83,51.62 38.29,53.16 34.14,53.16 JP1.1
N$11
  Bottom 0.203: 26.09,35.94 26.14,35.94 26.14,35.9
N$12
  Top 0.254: C36.1 5.21,16.57 5.56,16.93 6.3,16.93 U$7.P$1
N$17
  Top 0.254: U$7.P$6 3.92,15.9 C36.2 L$2.P$1
N$18
  Top 0.254: U$7.P$3 8.93,19.45 R41.2 10.21,19.48 R40.1
N$21
  Top 0.203: U$16.P$210B5 7.47,27.1 8.6,27.1 8.9,27.4 11.9,27.4 12.1,27.2 12.1,24.3 11.1,23.3 11.1,23.31 R16.1
N$22
  Top 0.203: R22.1 12.78,30.65 9,30.65 8.47,30.12 U$16.P$203A5
N$27
  Top 0.254: R6.1 30.39,8.15 T1.1
N$28
  Top 0.254: R35.1 18.09,49.67 R12.2
N$39
  Top 0.203: R18.2 13.92,44.53 R17.1
NRST
  Top 0.254: R3.2 29.32,23.46 27.88,22.01 27.88,20.32 23.04,15.49 21.84,15.49 21.19,14.84 21.19,13.99 19.55,12.35 17.89,12.35 17.73,12.19 17.73,11.32 ESP32C3-MINI-1.P$16 | 17.71,11.3 ESP32C3-MINI-1.P$16 | 17.7,11.29 ESP32C3-MINI-1.P$16
NRSTI  (via drill 0.3)
  Top 0.254: v29.71,35.64 29.46,35.5 29.46,26.25 R3.1 | R3.1 29.28,26.07 | R2.2 R3.1
  Bottom 0.203: U$1.P$9 30.92,39.71 31.3,39.33 31.3,36.23
  Bottom 0.254: 31.3,36.23 30.71,35.64 v29.71,35.64
P$5
  Top 0.254: U$14.5 20.16,20.28 | C7.2 17.97,22.65 L4.2 19.16,22.38 20.16,21.38 20.16,20.28 | 20.16,20.28
RI  (via drill 0.3)
  Top 0.254: R29.2 18.85,41.43 v18.48,41.81
  Bottom 0.254: U$1.P$27 18.84,41.15 18.48,41.51 v18.48,41.81
RO  (via drill 0.4)
  Top 0.203: T1.2 29.15,13.4 30.23,14.47 30.23,35.1 30.44,35.31 30.44,38.64 v30.48,38.67
  Top 0.254: T1.2 31.67,11.29 R7.1
  Bottom 0.203: U$1.P$10 30.1,39.23 30.5,38.83 v30.48,38.67
T_NTC  (via drill 0.6)
  Top 0.203: R37.2 24.04,35.25 24.04,25.7 23.85,25.51 23.85,23.22 R34.1 23.87,20.89 C34.2 23.88,20.46 23.88,17.88 v22.64,16.64 | v20.52,9.74 20.52,7.01 21.18,6.36 21.97,6.36 ESP32C3-MINI-1.P$6
  Bottom 0.203: v22.64,16.64 22.64,11.85 v20.52,9.74
VCORE  (via drill 0.6)
  Top 0.203: R36.1 26.58,43.62 26.5,43.7 | 26.51,43.7 26.51,44.21 27.9,45.6 29.3,47 29.3,47.85 | 20.67,48.16 R35.2 | 2.15,60.88 2.15,60.72 6.97,60.72 6.97,60.9 2.17,60.9 2.17,61.09 6.89,61.09 6.89,61.23 2.13,61.23 2.13,61.71 6.86,61.71 6.86,61.88 2.23,61.88 2.23,62.06 6.83,62.06 6.83,62.23 2.2,62.23 2.2,62.35 6.66,62.35
  Top 0.254: 20.67,48.16 C5.2 | 22.66,44.44 22.66,42.26 26.5,42.26 26.5,44.22 | 22.66,44.44 22.66,49.52 | 22.66,49.52 29.32,49.52 29.32,47.04 26.5,44.22 | C15.2 22.66,44.44 | R35.2 22.5,49.67 22.66,49.52 | 26.5,43.7 25.59,43.7 25.39,43.9 26.09,43.9 26.41,44.22 25.06,44.22 24.03,43.18 | 26.5,44.22 26.5,44.5 v23.99,47.01 | 26.5,44.22 26.52,44.22 27.9,45.6
  Top 0.406: 10.38,72.06 14.71,72.06 14.71,68.33 10.49,68.33 10.49,71.92 10.85,71.92 U$3.P$2 | 18.64,60.91 18.64,60.82 23.59,60.82 23.59,61.16 18.77,61.16 18.77,61.72 23.27,61.72 23.27,62.05 18.9,62.05 18.9,62.27 23.27,62.27
  Bottom 0.203: 21.3,43 U$1.P$33 23.5,43 26.5,44.05 | 26.35,43.9 26.5,43.8 | 26.5,43.8 26.5,44.05 | 26.5,43.8 26.5,43.3 20.4,43.3 20.4,46.3 23.15,49.05 23.8,49.05 | 26.5,44.05 26.5,44.2 29.7,47.4 29.7,64.86 27.3,64.86 | 27.3,64.86 23.8,64.86 23.8,49.05 | 26.5,44.05 23.8,49.05 | v28.1,63.57 28.1,64.12 27.3,64.86
  Bottom 0.305: 20.6,43.9 26.35,43.9
  other vias: 25.6,63.57 25.6,61.52 28.1,61.52 25.6,59.47 28.1,59.47 26.08,47.02 25.61,57.42 28.1,57.45
  pour Bottom: 23.86,64.77 23.85,49 23.2,49 20.45,46.25 20.45,43.85 26.45,43.85 26.45,44.25 29.65,47.45 29.66,64.77
  pour Top: 22.75,49.42 22.75,42.39 26.38,42.39 26.38,44.22 26.73,44.58 26.73,44.6 29.23,47.1 29.23,49.42
  pour Top: 0.34,73.19 29.66,73.19 29.66,55.31 23.86,55.31 23.86,60.67 0.34,60.67
VDD1  (via drill 0.6)
  Top 0.254: v16.7,42.67 16.73,42.64 C12.2 20.46,42.64 21.12,41.98 21.17,41.98 C13.1
  Bottom 0.254: U$1.P$30 16.79,42.59 v16.7,42.67
VDD2  (via drill 0.6)
  Top 0.254: v17.61,43.91 17.88,43.67 20.46,43.67 | C14.1 20.39,43.75 20.46,43.67 | C13.2 21.8,42.86 20.99,43.67 20.46,43.67
  Bottom 0.254: v17.61,43.91 18.48,43.07 U$1.P$31
VDD3  (via drill 0.6)
  Top 0.254: v18.69,44.88 19.57,45.76 C14.2 20.41,45.74 C15.1
  Bottom 0.254: 19.55,43.55 U$1.P$32 19.66,44.02 v18.69,44.88
VDD5  (via drill 0.3, 0.6)
  Top 0.203: 19.99,51.27 19.27,51.98 16.2,51.98 16.2,51.8 v16.09,51.68 | 14.59,51.77 16.51,51.77 16.6,51.68 | v15.06,51.68 15.06,51.7 15,51.76 | 9.44,52.57 8.61,52.82 8.54,53.11
  Top 0.254: C11.2 15.29,52.01 | v15.06,51.68 15.29,51.91 15.29,52.01 | 15.29,52.01 15.31,52.03 | 14,52.05 14.59,52.23 14.59,51.77 13.99,52.05 | 9.26,51.38 9.44,51.71 | 9.44,51.71 10.31,52.05 9.66,52.31 9.66,53.11 8.54,53.11 8.32,53.32 8.32,53.58 | 3.51,53.57 4.91,50.43 8.66,50.45 9.46,51.71 9.44,51.71 | 9.44,52.57 9.36,52.84 C10.2 | U$7.P$5 U$7.P$4 4.65,20.18 C37.1 4.65,21.05 4.8,21.05 6.45,22.7 7.46,22.7 9.04,24.27 9.04,24.65 v9.68,25.29 | 2.75,53.05 2.75,53.59 8.39,53.59 8.88,53.1 | 14.71,51.27 19.99,51.27 20.41,51.27 20.41,53.58 16.29,53.58 16.29,53.12 14.95,53.12 arc90 14.71,52.88 14.71,51.27
  Top 0.305: U$2.P$11 8.54,52.03 | U$2.P$2 15.31,52.03 16.09,52.03 arc90 16.21,52.16 | C10.2 9.11,52.89 v9.09,51.68 | 20.41,51.27 20.87,51.27 21.42,50.72 21.42,50.7 21.83,50.3 22.77,50.3 22.95,50.11 30.45,50.11 30.93,49.64 30.93,48.45 31.3,48.08 34.1,48.08 JP1.3 | 16.31,53.52 16.85,53.52 17.79,52.58
  Top 0.406: v7.04,51.68 5.52,51.68 C26.1 | C9.1 16.21,52.16 v16.09,51.68 16.6,51.68 v17.11,51.68 C8.1 | C18.1 7.83,51.92 v8.06,51.68 8.55,51.68 | 8.54,52.03 8.54,51.69 | 8.54,51.69 8.55,51.68 | v9.09,51.68 8.55,51.68 | 8.54,51.69 8.54,50.63 8.25,50.34 8.12,50.34 5.28,47.49 5.3,45.88 | 14.96,51.57 arc90 15.05,51.48 20.15,51.48 20.15,53.32 17,53.28 17,52.84 14.99,52.84 14.99,52.3 15.35,52.3 15.35,52.28 19.95,52.28 19.95,52.93 17.6,52.93 17.6,52.62 18.31,52.62 18.18,52.58 17.79,52.58 15.39,52.58 15.39,51.78 16.18,51.78 16.18,51.91 16.2,51.91 16.2,51.98 19.88,51.98 19.88,51.8 19.89,51.8 19.89,51.73 17.4,51.73 | 14.85,51.34 14.86,51.76 15,51.76 | 5.2,53.33 5.2,53.32 8.03,53.4 8.03,52.58 9.44,52.57 9.44,51.9 9.2,51.9 8.75,50.7 8.85,50.99 8.85,52.52 8.49,52.52 8.49,52.24 6.8,52.24 6.8,53.09 6.42,53.09 | 6.42,53.09 6.42,53.11 | 6.42,53.09 6.42,52.26 5.15,52.26 5.15,51.88 6.59,51.88 6.59,52.06 7.69,52.06 7.69,51.33 8.24,51.33 8.24,51.03 5.11,51.03 | 5.11,51.03 5.11,50.84 | 5.11,51.03 5.11,51.57 5.36,51.57 5.36,51.36 7.45,51.36 7.45,51.82 | 15.51,52.77 16.31,53.52
  Top 0.457: v9.7,32.92 v9.7,31.76
  Top 0.503: U$16.P$211B4A9 9.65,26.42 v9.68,26.44 | U$16.P$201A4B9 9.27,31.32 v9.7,31.76
  Top 0.506: v9.71,32.92 | 9.68,26.62 v9.68,26.44 | 9.7,31.52 v9.7,31.76
  Top 0.813: 4.2,43.86 4.17,43.86 4.17,40.6
  Top 1.016: 3.88,52.05 3.88,53.1 4.55,53.1 4.55,52.56 8.63,52.56
  Bottom 1.27: v17.11,51.68 v9.09,51.68 v7.04,51.68
  other vias: 11.04,32.92 11.03,31.76 11.03,26.44 11.03,25.3
  pour Top: 9.31,33.31 11.43,33.31 11.43,31.38 9.31,31.38
  pour Top: 9.27,26.84 11.43,26.84 11.43,24.89 9.27,24.89
  pour Bottom: 8.85,33.8 11.85,33.8 11.85,24.35 8.85,24.35
  pour Top: 11.91,31.19 11.91,36.69 7.06,36.69 6.7,37.11 6.69,47.88 8.71,50.03 8.71,52.61 7.75,53.59 2.47,53.59 2.48,36.3 3.69,34.51 8.84,34.51 8.84,31.19
VDD08  (via drill 0.3)
  Top 0.254: R14.1 15.62,39.83 C1.2 16.34,39.11 16.34,37.83 | 16.05,37.67 R11.2 16.34,37.83 | v17.61,37.58 17.55,37.58 17.3,37.83 16.34,37.83
  Bottom 0.254: U$1.P$18 18.36,36.83 v17.61,37.58
VDD08_1  (via drill 0.3)
  Top 0.254: v27.88,35.23 C6.1
  Bottom 0.254: 28.12,36.83 28.12,37.31 U$1.P$14 | 28.12,36.83 28.12,35.52 v27.88,35.23 | U$1.P$15 28.12,36.83
VDD33  (via drill 0.6)
  Top 0.254: 25.48,3.9 25.48,4.97 R26.1 25.49,5.17 25.49,8.47 R25.2 25.3,9.28 25.45,9.43 25.45,12.87 | C20.2 25.48,3.89 25.48,3.9 | R8.2 25.45,12.87 | 25.45,12.87 25.45,14.62 v25.45,14.91 | ESP32C3-MINI-1.P$3 25.39,3.98 25.48,3.9 | 22.12,22.66 R34.2 | R40.2 10.62,16.98 v10.65,16.95 9.41,16.95 6.97,14.51 6.97,13.42 6.31,12.75 L$2.P$2 | 6.25,8.58 D1.VCC 6.02,8.77 C38.1 | 22.11,22.7 20.51,22.7 L4.1
  Top 0.305: X1.2 41.01,28.44 | 41.01,28.44 | v33.34,20.24 v33.33,20.25 33.33,22.99 33.17,23.19 33.17,28 33.6,28.44 41.01,28.44 | 6.31,12.75 C38.1 | v22.16,21.07 22.16,22.65 R34.2 22.11,22.7 22.11,28.73 20.98,29.87 20.98,30.48 C2.2 20.82,31.93 U$4.3 20.29,32.47
  Top 0.406: v25.45,14.91 25.45,16.29 v29.35,20.26
  Bottom 0.305: v25.45,14.91 25.45,16.3 22.18,19.58 | 22.18,19.58 22.18,21.05 v22.16,21.07 | 22.18,19.58 18.3,15.7 11.9,15.7 v10.65,16.95 | v29.35,20.26 33.32,20.26 v33.34,20.24
VDDIO18  (via drill 0.3, 0.6)
  Top 0.254: 18.84,38.17 R29.1 | 18.66,36.27 v18.51,36.11 | R6.2 32.8,10.56 32.8,12.3 32.55,12.55 31.76,12.55 R7.2 30.83,12.62 v30.4,13.05
  Top 0.305: U$4.2 19.19,34.55 19.19,30.34 19.2,30.34 21.5,28.05 21.5,25.44 v21.21,25.16 | R11.1 16.64,36.11 v18.51,36.11 18.52,36.12 18.52,36.84 18.84,37.15 18.84,38.17
  Top 0.406: v18.51,36.11 18.51,35.61 | 18.51,35.61 18.51,35.49 U$4.2 | R29.1 | C3.2 17.23,34.32 18.51,35.61
  Bottom 0.254: v30.4,13.05 29.5,13.05 23,19.55 23,23.41 21.27,25.16 | U$1.P$17 18.62,36.35 v18.51,36.11
  Bottom 0.305: v21.21,25.16 21.27,25.16
VDDIO18_1  (via drill 0.3)
  Top 0.254: v26.45,35.23 26.45,34.18 C35.1 26.43,34.15 25.55,34.15 25.22,33.82 U$22.P$4 25.22,31.22 25.17,31.22 U$22.P$1
  Bottom 0.254: U$1.P$16 27.26,36.09 v26.45,35.23

### Text on the board
tNames: V0.4k | aSiNine / &8